# EAGLE design servo driver (EAGLE 9.4.2)
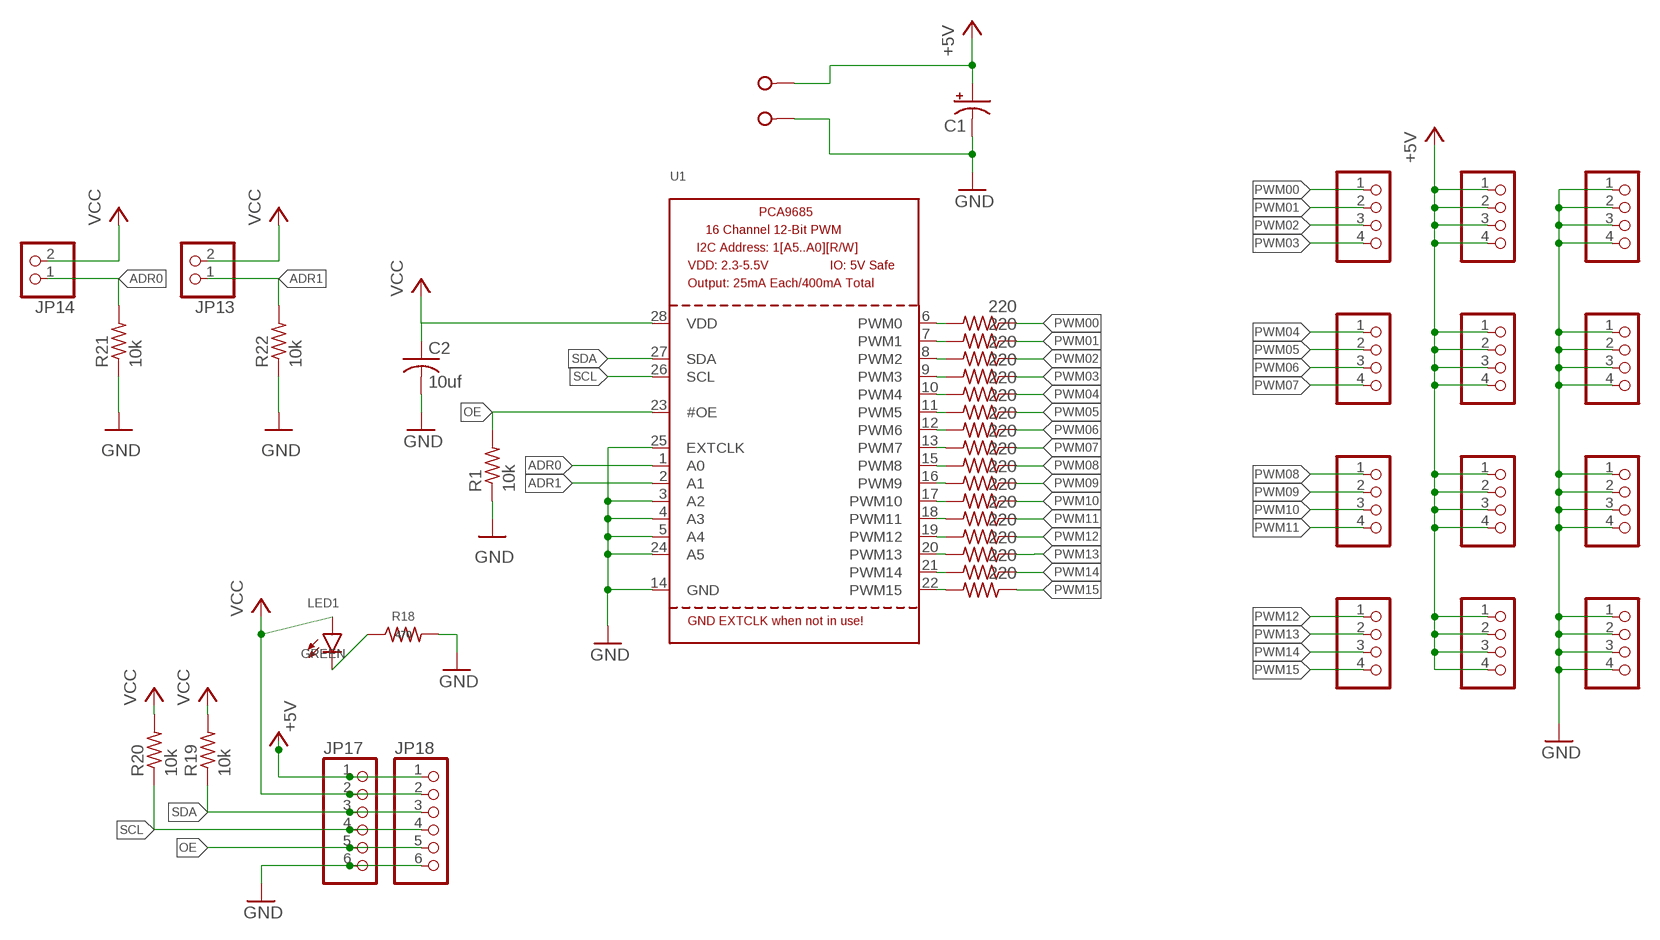
[diagram p0: schematic, sheet 1]

## Parts
C1  CPOL-USE5-8.5  [E5-8,5]
C2  10uf  C-US025-024X044  [C025-024X044]
JP1  PINHD-1X4  [1X04]
JP2  PINHD-1X4  [1X04]
JP3  PINHD-1X4  [1X04]
JP4  PINHD-1X4  [1X04]
JP5  PINHD-1X4  [1X04]
JP6  PINHD-1X4  [1X04]
JP7  PINHD-1X4  [1X04]
JP8  PINHD-1X4  [1X04]
JP9  PINHD-1X4  [1X04]
JP10  PINHD-1X4  [1X04]
JP11  PINHD-1X4  [1X04]
JP12  PINHD-1X4  [1X04]
JP13  PINHD-1X2  [1X02]
JP14  PINHD-1X2  [1X02]
JP17  PINHD-1X6CB  [1X06-CLEANBIG]
JP18  PINHD-1X6CB  [1X06-CLEANBIG]
LED1  GREEN  LED3MM  [LED3MM]
R1  10k  R-US_0207/10  [0207/10]
R2  220  R-US_0207/10  [0207/10]
R3  220  R-US_0207/10  [0207/10]
R4  220  R-US_0207/10  [0207/10]
R5  220  R-US_0207/10  [0207/10]
R6  220  R-US_0207/10  [0207/10]
R7  220  R-US_0207/10  [0207/10]
R8  220  R-US_0207/10  [0207/10]
R9  220  R-US_0207/10  [0207/10]
R10  220  R-US_0207/10  [0207/10]
R11  220  R-US_0207/10  [0207/10]
R12  220  R-US_0207/10  [0207/10]
R13  220  R-US_0207/10  [0207/10]
R14  220  R-US_0207/10  [0207/10]
R15  220  R-US_0207/10  [0207/10]
R16  220  R-US_0207/10  [0207/10]
R17  220  R-US_0207/10  [0207/10]
R18  470  R-US_0207/10  [0207/10]
R19  10k  R-US_0207/10  [0207/10]
R20  10k  R-US_0207/10  [0207/10]
R21  10k  R-US_0207/10  [0207/10]
R22  10k  R-US_0207/10  [0207/10]
U1  PCA9685  [TSSOP28]
X1  W237-02P  [W237-132]

## Nets
+5V: C1.+ JP5.1 JP5.2 JP5.3 JP5.4 JP6.1 JP6.2 JP6.3 JP6.4 JP7.1 JP7.2 JP7.3 JP7.4 JP8.1 JP8.2 JP8.3 JP8.4 JP17.1 JP18.1 X1.1
ADR0: JP14.1 R21.2 U1.1(A0)
ADR1: JP13.1 R22.2 U1.2(A1)
GND: C1.- C2.2 JP9.1 JP9.2 JP9.3 JP9.4 JP10.1 JP10.2 JP10.3 JP10.4 JP11.1 JP11.2 JP11.3 JP11.4 JP12.1 JP12.2 JP12.3 JP12.4 JP17.6 JP18.6 R1.1 R18.2 R21.1 R22.1 U1.3(A2) U1.4(A3) U1.5(A4) U1.14(GND) U1.24(A5) U1.25(EXTCLK) X1.2
N$1: R2.2 U1.6(PWM0)
N$2: R3.2 U1.7(PWM1)
N$3: R4.2 U1.8(PWM2)
N$4: R5.2 U1.9(PWM3)
N$5: R6.2 U1.10(PWM4)
N$6: R7.2 U1.11(PWM5)
N$7: R8.2 U1.12(PWM6)
N$8: R9.2 U1.13(PWM7)
N$9: R10.2 U1.15(PWM8)
N$10: R11.2 U1.16(PWM9)
N$11: R12.2 U1.17(PWM10)
N$12: R13.2 U1.18(PWM11)
N$13: R14.2 U1.19(PWM12)
N$14: R15.2 U1.20(PWM13)
N$15: R16.2 U1.21(PWM14)
N$16: R17.2 U1.22(PWM15)
N$17: LED1.K(C) R18.1
OE: JP17.5 JP18.5 R1.2 U1.23(#OE)
PWM00: JP1.1 R2.1
PWM01: JP1.2 R3.1
PWM02: JP1.3 R4.1
PWM03: JP1.4 R5.1
PWM04: JP2.1 R6.1
PWM05: JP2.2 R7.1
PWM06: JP2.3 R8.1
PWM07: JP2.4 R9.1
PWM08: JP3.1 R10.1
PWM09: JP3.2 R11.1
PWM10: JP3.3 R12.1
PWM11: JP3.4 R13.1
PWM12: JP4.1 R14.1
PWM13: JP4.2 R15.1
PWM14: JP4.3 R16.1
PWM15: JP4.4 R17.1
SCL: JP17.4 JP18.4 R20.1 U1.26(SCL)
SDA: JP17.3 JP18.3 R19.1 U1.27(SDA)
VCC: C2.1 JP13.2 JP14.2 JP17.2 JP18.2 LED1.A R19.2 R20.2 U1.28(VDD)

## Library data of the parts
C1 = resistor:CPOL-US: POLARIZED CAPACITOR, American symbol
C2 = resistor:C-US: CAPACITOR, American symbol
JP1-JP12 = pinheadoct:PINHD-1X4: PIN HEADER
JP13 JP14 = pinheadoct:PINHD-1X2: PIN HEADER
JP17 JP18 = adafruit:PINHD-1X6: PIN HEADER
LED1 = led:LED: LED OSRAM: - CHIPLED LG R971, LG N971, LY N971, LG Q971, LY Q971, LO R971, LY R971 LH N974, LH R974 LS Q976, LO Q976, LY Q976 LO Q996 - Hyper CHIPLED LW Q18S LB Q993, LB Q99A, LB R99A - SideLED LS A670, LO A670, LY A670, LG A670, LP A670 LB A673, LV A673, LT A673, LW A673 LH A674 LY A675 LS A676, LA A676, LO A676, LY A676, LW A676 LS A679, LY A679, LG A679 - Hyper Micro SIDELED® LS Y876, LA Y876, LO Y876, LY Y876 LT Y87S - SmartLED LW L88C, LW L88S LB L89C, LB L89S, LG L890 LS L89K, LO L89K, LY L89K LS L896, LA L896, LO L896, LY L896 - TOPLED LS T670, LO T670, LY T670, LG T670, LP T670 LSG T670, LSP T670, LSY T670, LOP T670, LYG T670 LG T671, LOG T671, LSG T671 LB T673, LV T673, LT T673, LW T673 LH T674 LS T676, LA T676, LO T676, LY T676, LB T676, LH T676, LSB T676, LW T676 LB T67C, LV T67C, LT T67C, LS T67K, LO T67K, LY T67K, LW E67C LS E67B, LA E67B, LO E67B, LY E67B, LB E67C, LV E67C, LT E67C LW T67C LS T679, LY T679, LG T679 LS T770, LO T770, LY T770, LG T770, LP T770 LB T773, LV T773, LT T773, LW T773 LH T774 LS E675, LA E675, LY E675, LS T675 LS T776, LA T776, LO T776, LY T776, LB T776 LHGB T686 LT T68C, LB T68C - Hyper Mini TOPLED® LB M676 - Mini TOPLED Santana® LG M470 LS M47K, LO M47K, LY M47K Source: http://www.osram.convergy.de LUXEON: - LUMILED® LXK2-PW12-R00, LXK2-PW12-S00, LXK2-PW14-U00, LXK2-PW14-V00 LXK2-PM12-R00, LXK2-PM12-S00, LXK2-PM14-U00 LXK2-PE12-Q00, LXK2-PE12-R00, LXK2-PE12-S00, LXK2-PE14-T00, LXK2-PE14-U00 LXK2-PB12-K00, LXK2-PB12-L00, LXK2-PB12-M00, LXK2-PB14-N00, LXK2-PB14-P00, LXK2-PB14-Q00 LXK2-PR12-L00, LXK2-PR12-M00, LXK2-PR14-Q00, LXK2-PR14-R00 LXK2-PD12-Q00, LXK2-PD12-R00, LXK2-PD12-S00 LXK2-PH12-R00, LXK2-PH12-S00 LXK2-PL12-P00, LXK2-PL12-Q00, LXK2-PL12-R00 Source: www.luxeon.com KINGBRIGHT: KA-3528ASYC Source: www.kingbright.com
R1-R22 = resistor:R-US_: RESISTOR, American symbol
U1 = adafruit:PCA9685: PCA9685 - 16 Channel 12-Bit I2C PWM Controller 5.0V tolerant 16 channel, 12-bit I2C PWM controller with 25mA per output (max. 400mA total) Digikey: 568-5931-1-ND
X1 = con-wago-508:W237-02P: WAGO SREW CLAMP; OC_FARNELL: unknown; OC_NEWARK: unknown

## Board
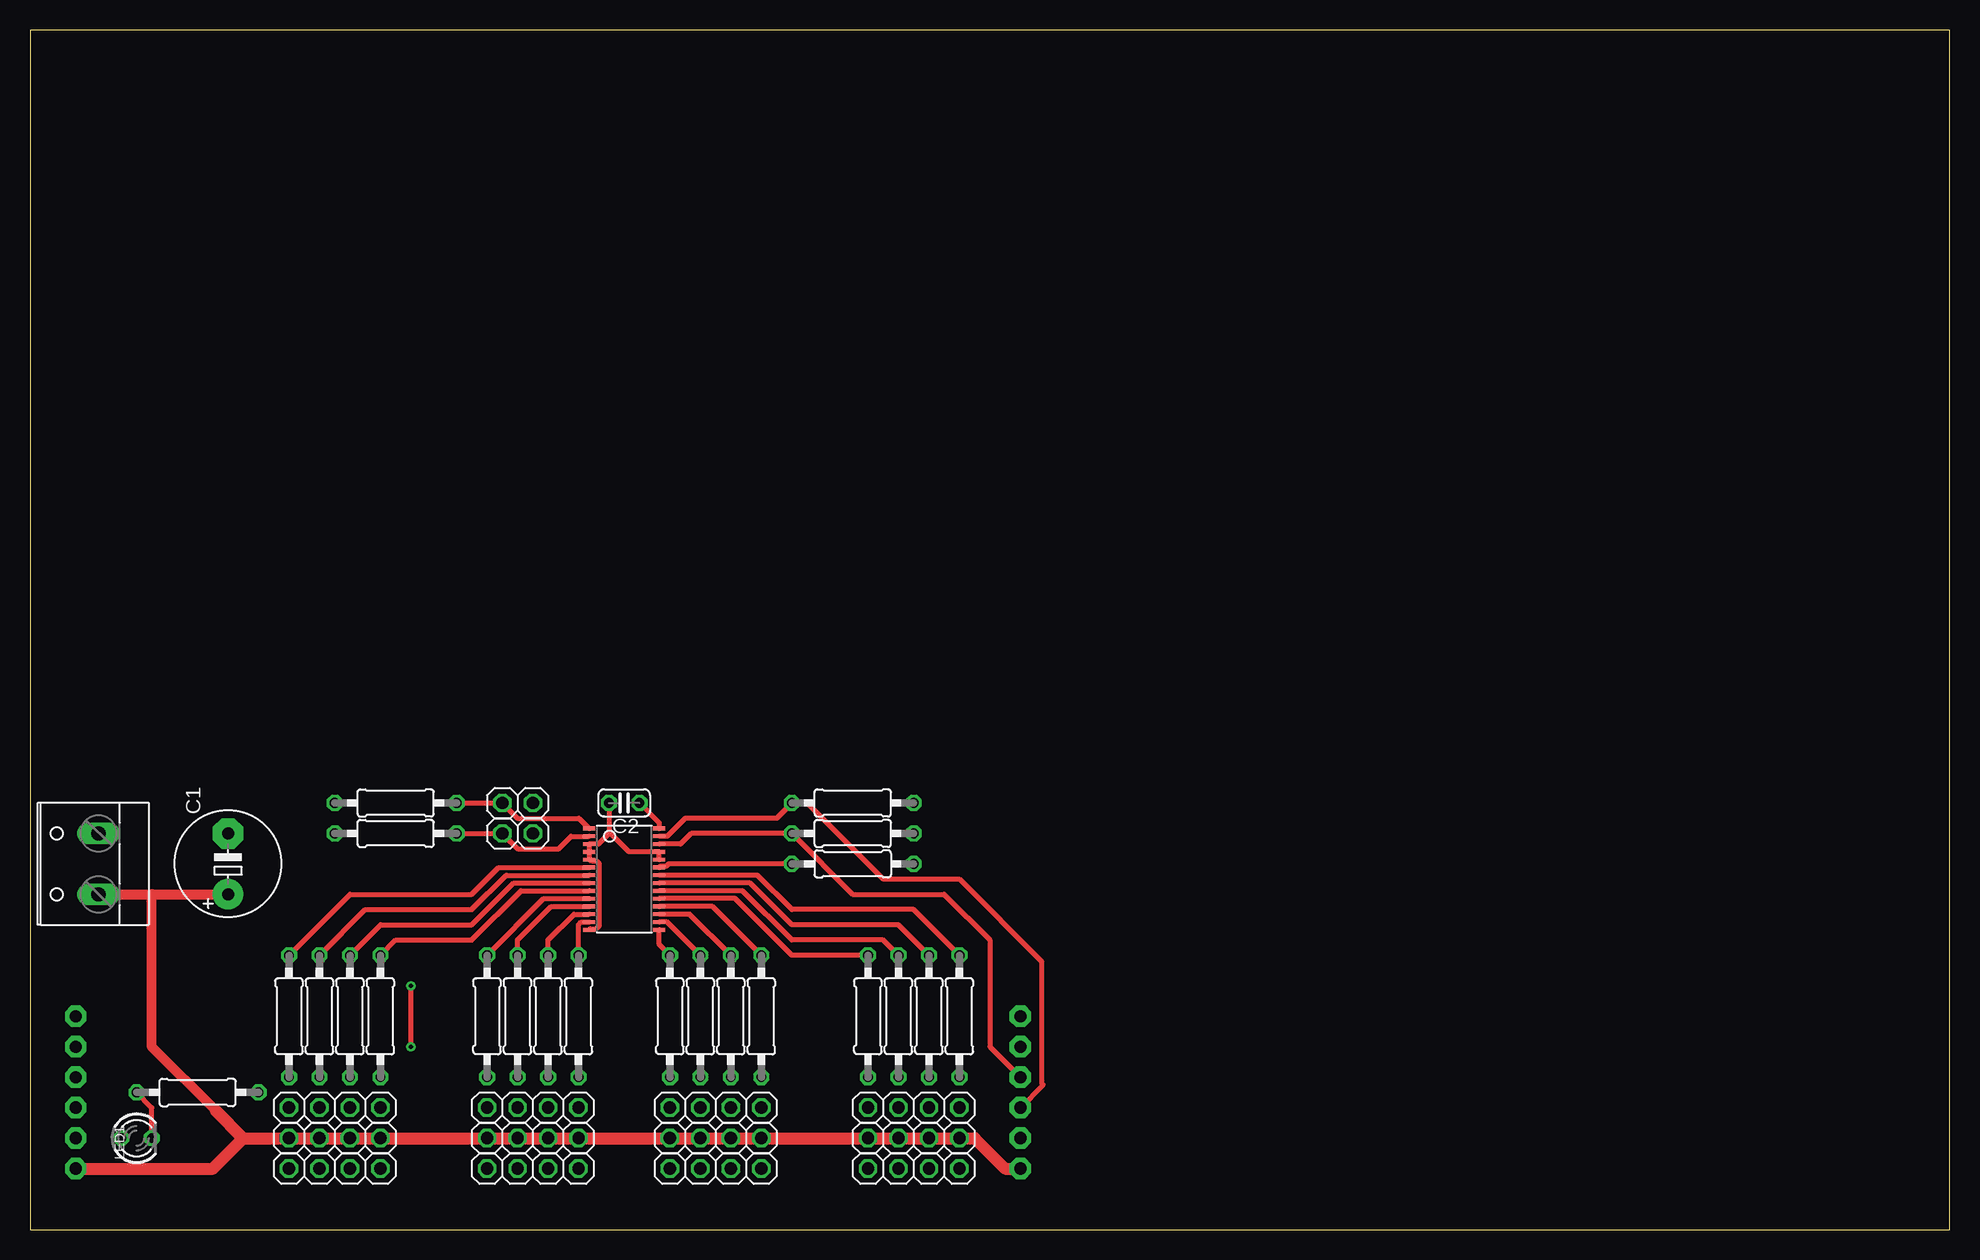
[diagram p1: board, top side]
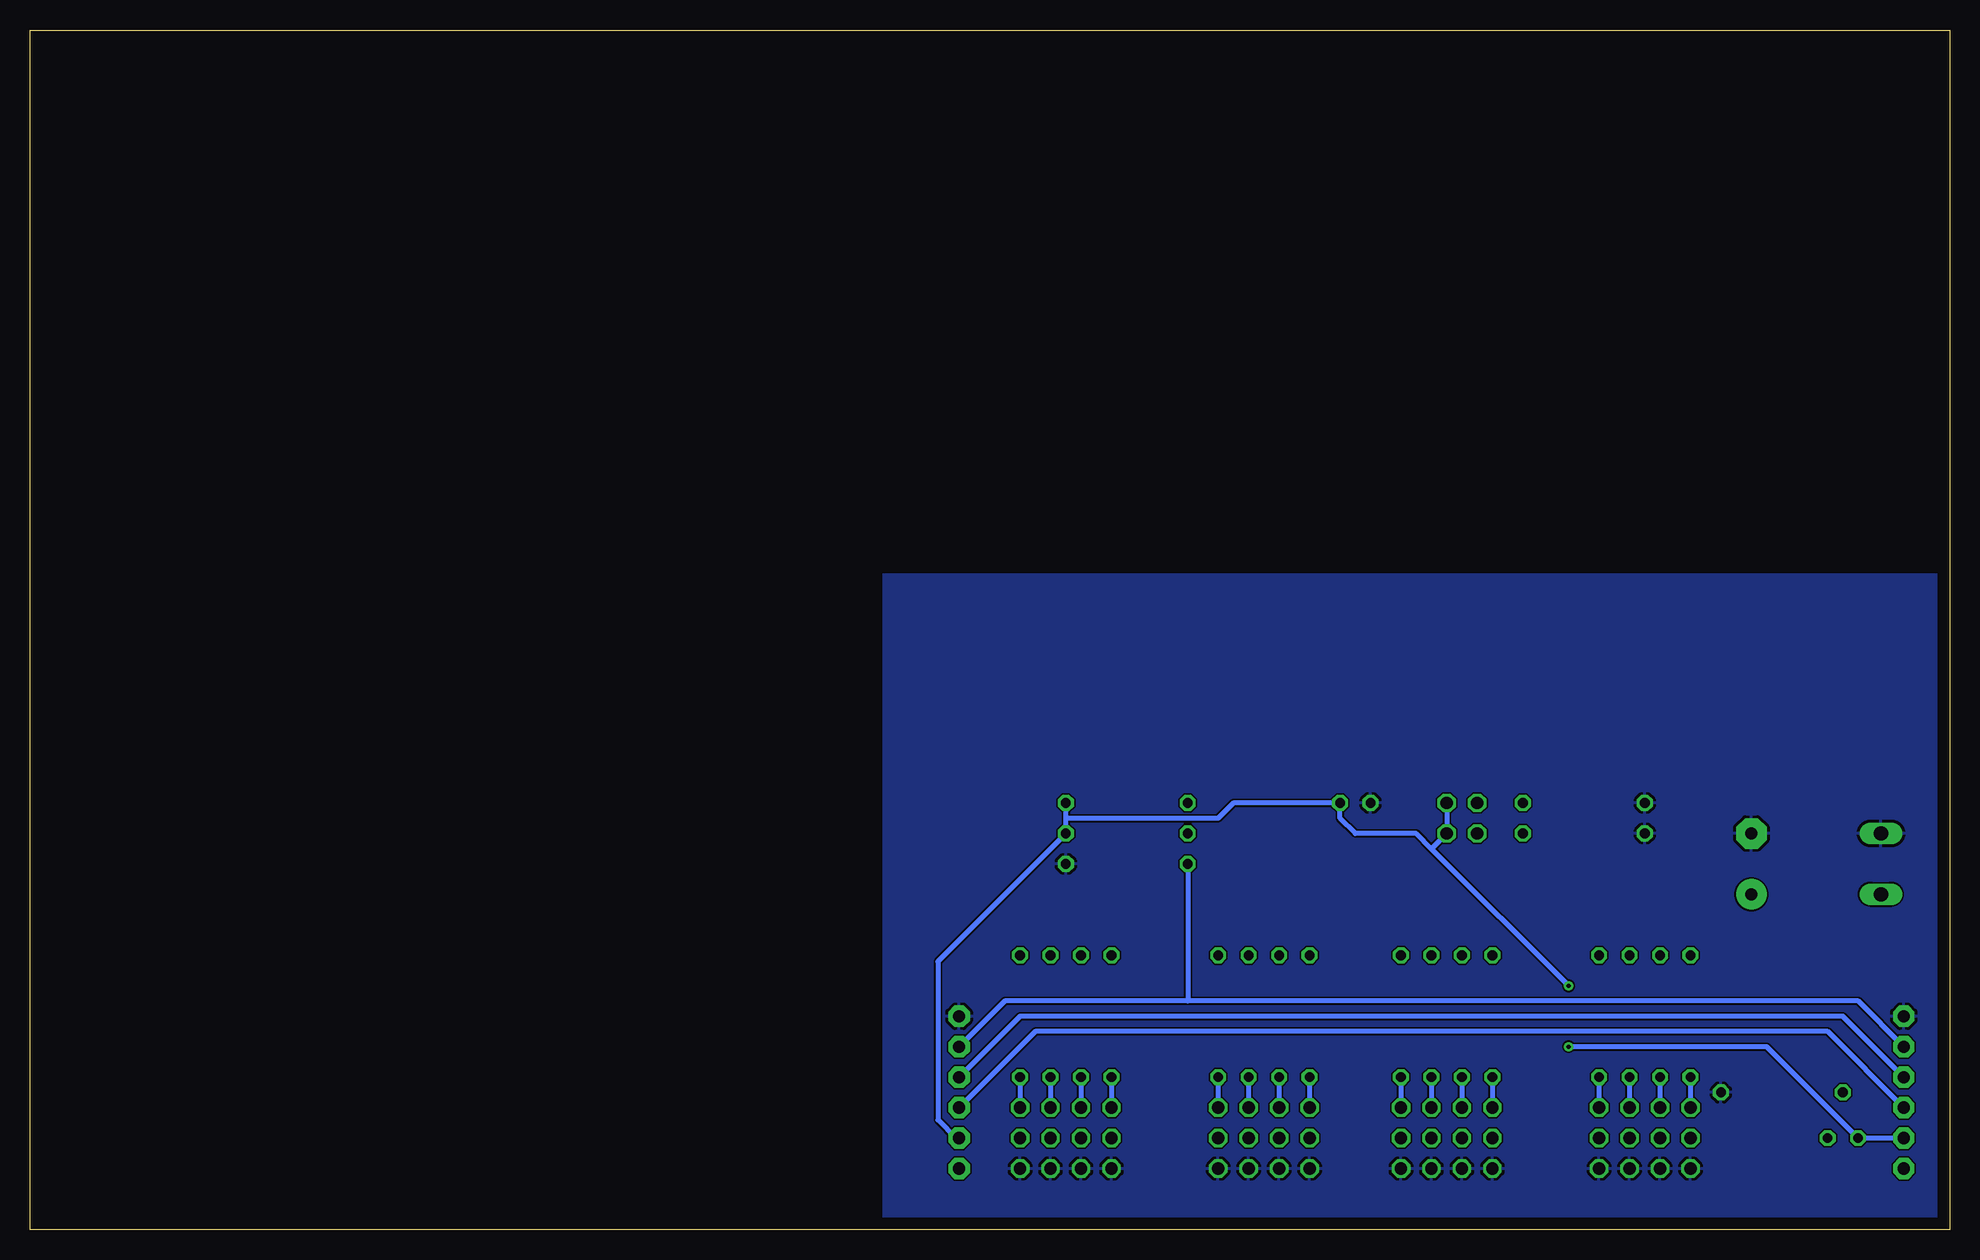
[diagram p2: board, bottom side, seen from below]

Size 160 x 100 mm. Coordinates in mm from the lower left corner, seen from the top.
Outline: 0,0 160,0 160,100 0,100 0,0
Copper layers (1*16): Top 0.035mm / dielectric 1.5mm / Bottom 0.035mm
Design rules "default": minimum track width 6mil, minimum drill 0.35mm, track to track 6mil, track to pad 6mil, pad to pad 6mil, via to via 6mil, smd to smd 6mil, copper to edge 40mil, drill to drill 6mil, minimum pad ring 10mil, minimum via ring 8mil, stop-mask expansion 4mil, vias tented up to drill 0mil, thermal gap 10mil

### Footprints (pad centres in the part's own frame; a part is rotated, then mirrored left to right if it is on the bottom)
E5-8,5 = drill 1.016 pad 2.54: + -2.54,0 | drill 1.016 pad 2.54 octagon: - 2.54,0
C025-024X044 = drill 0.813 octagon: 1 -1.27,0; 2 1.27,0
1X04 = drill 1.016 octagon: 1 -3.81,0; 2 -1.27,0; 3 1.27,0; 4 3.81,0
1X02 = drill 1.016 octagon: 1 -1.27,0; 2 1.27,0
1X06-CLEANBIG = drill 1.016 pad 1.778 octagon: 1 -6.35,0; 2 -3.81,0; 3 -1.27,0; 4 1.27,0; 5 3.81,0; 6 6.35,0
LED3MM = drill 0.813 octagon: A -1.27,0; K 1.27,0
0207/10 = drill 0.813 octagon: 1 -5.08,0; 2 5.08,0
TSSOP28 = smd 0.305 x 0.991: 1 -4.225,-2.918; 2 -3.575,-2.918; 3 -2.925,-2.918; 4 -2.275,-2.918; 5 -1.625,-2.918; 6 -0.975,-2.918; 7 -0.325,-2.918; 8 0.325,-2.918; 9 0.975,-2.918; 10 1.625,-2.918; 11 2.275,-2.918; 12 2.925,-2.918; 13 3.575,-2.918; 14 4.225,-2.918; 15 4.225,2.918; 16 3.575,2.918; 17 2.925,2.918; 18 2.275,2.918; 19 1.625,2.918; 20 0.975,2.918; 21 0.325,2.918; 22 -0.325,2.918; 23 -0.975,2.918; 24 -1.625,2.918; 25 -2.275,2.918; 26 -2.925,2.918; 27 -3.575,2.918; 28 -4.225,2.918
W237-132 = drill 1.194 long: 1 -2.54,-0.635; 2 2.54,-0.635

### Placement (x,y rotation side)
C1  16.51,30.48 90 top
C2  49.53,35.56 180 top
JP1  25.4,10.16 0 top
JP2  41.91,10.16 0 top
JP3  57.15,10.16 0 top
JP4  73.66,10.16 0 top
JP5  25.4,7.62 0 top
JP6  41.91,7.62 0 top
JP7  57.15,7.62 0 top
JP8  73.66,7.62 0 top
JP9  25.4,5.08 0 top
JP10  41.91,5.08 0 top
JP11  57.15,5.08 0 top
JP12  73.66,5.08 0 top
JP13  40.64,33.02 0 top
JP14  40.64,35.56 0 top
JP17  82.55,11.43 90 top
JP18  3.81,11.43 90 top
LED1  8.89,7.62 0 top
R1  68.58,30.48 180 top
R2  21.59,17.78 90 top
R3  24.13,17.78 90 top
R4  26.67,17.78 90 top
R5  29.21,17.78 90 top
R6  38.1,17.78 90 top
R7  40.64,17.78 90 top
R8  43.18,17.78 90 top
R9  45.72,17.78 90 top
R10  53.34,17.78 90 top
R11  55.88,17.78 90 top
R12  58.42,17.78 90 top
R13  60.96,17.78 90 top
R14  69.85,17.78 90 top
R15  72.39,17.78 90 top
R16  74.93,17.78 90 top
R17  77.47,17.78 90 top
R18  13.97,11.43 0 top
R19  68.58,35.56 0 top
R20  68.58,33.02 0 top
R21  30.48,35.56 0 top
R22  30.48,33.02 0 top
U1  49.53,29.21 270 top
X1  5.08,30.48 90 top

### Tracks (layer width: path | path; a pad name or v marks a point on that pad's centre or on a via)
+5V
  Top 0.813: X1.1 10.16,27.94 | 10.16,27.94 C1.+ | 10.16,27.94 10.16,15.24 15.52,9.88
  Top 1.016: JP18.1 15.24,5.08 17.78,7.62 | 17.78,7.62 JP5.1 JP5.2 JP5.3 JP5.4 JP6.1 JP6.2 JP6.3 JP6.4 JP7.1 JP7.2 JP7.3 JP7.4 JP8.1 JP8.2 JP8.3 JP8.4 78.74,7.62 81.28,5.08 JP17.1 | 17.78,7.62 15.52,9.88
ADR0
  Top 0.406: R21.2 JP14.1 40.64,34.29 45.76,34.29 U1.1
ADR1
  Top 0.406: R22.2 JP13.1 40.64,31.75 44.07,31.75 45.1,32.78 U1.2
GND
  Top 0.406: U1.14 46.7,25.08 47.2,25.08 47.46,25.34 47.46,30.48 47.26,30.69 46.89,30.69 46.84,30.74 46.7,30.74 U1.5 U1.4 U1.3 47.38,32.13 48.26,33.02 | C2.2 48.26,33.02 | U1.24 U1.25 49.92,31.48 48.39,33.02 48.26,33.02
  pour Bottom: -2.54,54.61 88.9,54.61 88.9,-1.27 -2.54,-1.27
N$1
  Top 0.406: R2.2 26.67,27.94 36.83,27.94 39.08,30.18 U1.6
N$2
  Top 0.406: R3.2 27.94,26.67 36.83,26.67 39.7,29.54 U1.7
N$3
  Top 0.406: R4.2 29.21,25.4 36.83,25.4 40.31,28.89 U1.8
N$4
  Top 0.406: R5.2 30.48,24.13 36.83,24.13 40.94,28.23 U1.9
N$5
  Top 0.406: U1.10 42.83,27.59 R6.2
N$6
  Top 0.406: R7.2 40.64,24.13 43.45,26.93 U1.11
N$7
  Top 0.406: R8.2 43.18,24.13 45.34,26.29 U1.12
N$8
  Top 0.406: U1.13 45.95,25.64 45.72,25.4 R9.2
N$9
  Top 0.406: R10.2 52.45,23.75 U1.15
N$10
  Top 0.406: U1.16 53.1,25.64 R11.2
N$11
  Top 0.406: U1.17 54.99,26.29 R12.2
N$12
  Top 0.406: U1.18 56.88,26.93 R13.2
N$13
  Top 0.406: R14.2 63.5,22.86 58.77,27.59 U1.19
N$14
  Top 0.406: R15.2 71.12,24.13 63.5,24.13 59.4,28.23 U1.20
N$15
  Top 0.406: R16.2 72.39,25.4 63.5,25.4 60.02,28.89 U1.21
N$16
  Top 0.406: R17.2 73.66,26.67 63.5,26.67 60.63,29.54 U1.22
N$17
  Top 0.406: LED1.K 10.16,10.16 R18.1
OE
  Top 0.406: U1.23 52.54,30.28 53.04,30.28 53.24,30.48 R1.2
  Bottom 0.406: JP18.5 7.62,19.05 63.5,19.05 | JP17.5 78.74,19.05 63.5,19.05 | R1.2 63.5,19.05
PWM00
  Bottom 0.406: R2.1 JP1.1
PWM01
  Bottom 0.406: R3.1 JP1.2
PWM02
  Bottom 0.406: R4.1 JP1.3
PWM03
  Bottom 0.406: R5.1 JP1.4
PWM04
  Bottom 0.406: R6.1 JP2.1
PWM05
  Bottom 0.406: R7.1 JP2.2
PWM06
  Bottom 0.406: R8.1 JP2.3
PWM07
  Bottom 0.406: R9.1 JP2.4
PWM08
  Bottom 0.406: R10.1 JP3.1
PWM09
  Bottom 0.406: R11.1 JP3.2
PWM10
  Bottom 0.406: R12.1 JP3.3
PWM11
  Bottom 0.406: R13.1 JP3.4
PWM12
  Bottom 0.406: R14.1 JP4.1
PWM13
  Bottom 0.406: R15.1 JP4.2
PWM14
  Bottom 0.406: R16.1 JP4.3
PWM15
  Bottom 0.406: R17.1 JP4.4
SCL
  Top 0.406: U1.26 54.23,32.13 55.12,33.02 R20.1 68.58,27.94 76.2,27.94 80.01,24.13 80.01,15.24 JP17.4
  Bottom 0.406: JP18.4 8.89,17.78 77.47,17.78 JP17.4
SDA
  Top 0.406: U1.27 53.1,32.78 54.61,34.29 62.23,34.29 R19.1 64.77,35.56 71.12,29.21 77.47,29.21 84.33,22.35 84.33,12.19 84.45,12.06 JP17.3
  Bottom 0.406: JP18.3 10.16,16.51 76.2,16.51 JP17.3
VCC  (via drill 0.35)
  Top 0.406: C2.1 52.45,33.91 U1.28 | v31.75,15.24 v31.75,20.32
  Bottom 0.406: 73.66,34.29 60.96,34.29 59.69,35.56 C2.1 50.8,34.29 49.53,33.02 44.45,33.02 43.18,31.75 | 73.66,34.29 R19.2 | 73.66,34.29 R20.2 84.33,22.35 84.33,9.14 82.8,7.62 JP17.2 | JP14.2 JP13.2 43.18,31.75 | v31.75,20.32 43.18,31.75 | JP18.2 LED1.A 15.24,15.24 v31.75,15.24

### Text on the board
tValues: 220